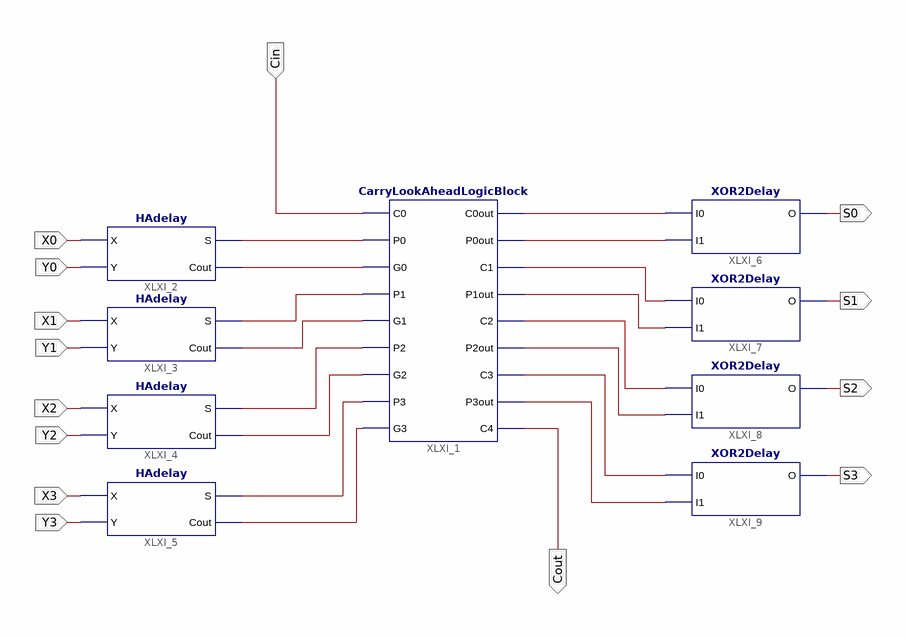
[diagram p0: schematic sheet 1]
// Xilinx ISE schematic CLA_FourBit.sch (spartan6) as structural Verilog: 9 symbols, 14 ports
module CLA_FourBit (
  input  Cin,
  input  X0,
  input  Y0,
  input  X3,
  input  Y3,
  input  X2,
  input  Y2,
  input  X1,
  input  Y1,
  output Cout,
  output S0,
  output S1,
  output S2,
  output S3
);

  wire XLXN_1, XLXN_2, XLXN_3, XLXN_4, XLXN_5, XLXN_8, XLXN_13, XLXN_14, XLXN_19, XLXN_20, XLXN_21, XLXN_22,
       XLXN_23, XLXN_24, XLXN_26, XLXN_27;

  CarryLookAheadLogicBlock XLXI_1 (
    .C0(Cin), .P0(XLXN_1), .G0(XLXN_2), .P1(XLXN_3), .G1(XLXN_4), .P2(XLXN_5), .G2(XLXN_13), .P3(XLXN_14),
    .G3(XLXN_8), .C0out(XLXN_19), .P0out(XLXN_20), .C1(XLXN_21), .P1out(XLXN_22), .C2(XLXN_23),
    .P2out(XLXN_24), .C3(XLXN_26), .P3out(XLXN_27), .C4(Cout));
  HAdelay XLXI_2 (.X(X0), .Y(Y0), .S(XLXN_1), .Cout(XLXN_2));
  HAdelay XLXI_3 (.X(X1), .Y(Y1), .S(XLXN_3), .Cout(XLXN_4));
  HAdelay XLXI_4 (.X(X2), .Y(Y2), .S(XLXN_5), .Cout(XLXN_13));
  HAdelay XLXI_5 (.X(X3), .Y(Y3), .S(XLXN_14), .Cout(XLXN_8));
  XOR2Delay XLXI_6 (.I0(XLXN_19), .I1(XLXN_20), .O(S0));
  XOR2Delay XLXI_7 (.I0(XLXN_21), .I1(XLXN_22), .O(S1));
  XOR2Delay XLXI_8 (.I0(XLXN_23), .I1(XLXN_24), .O(S2));
  XOR2Delay XLXI_9 (.I0(XLXN_26), .I1(XLXN_27), .O(S3));
endmodule
